# EAGLE design uirrc (EAGLE 9.6.2)
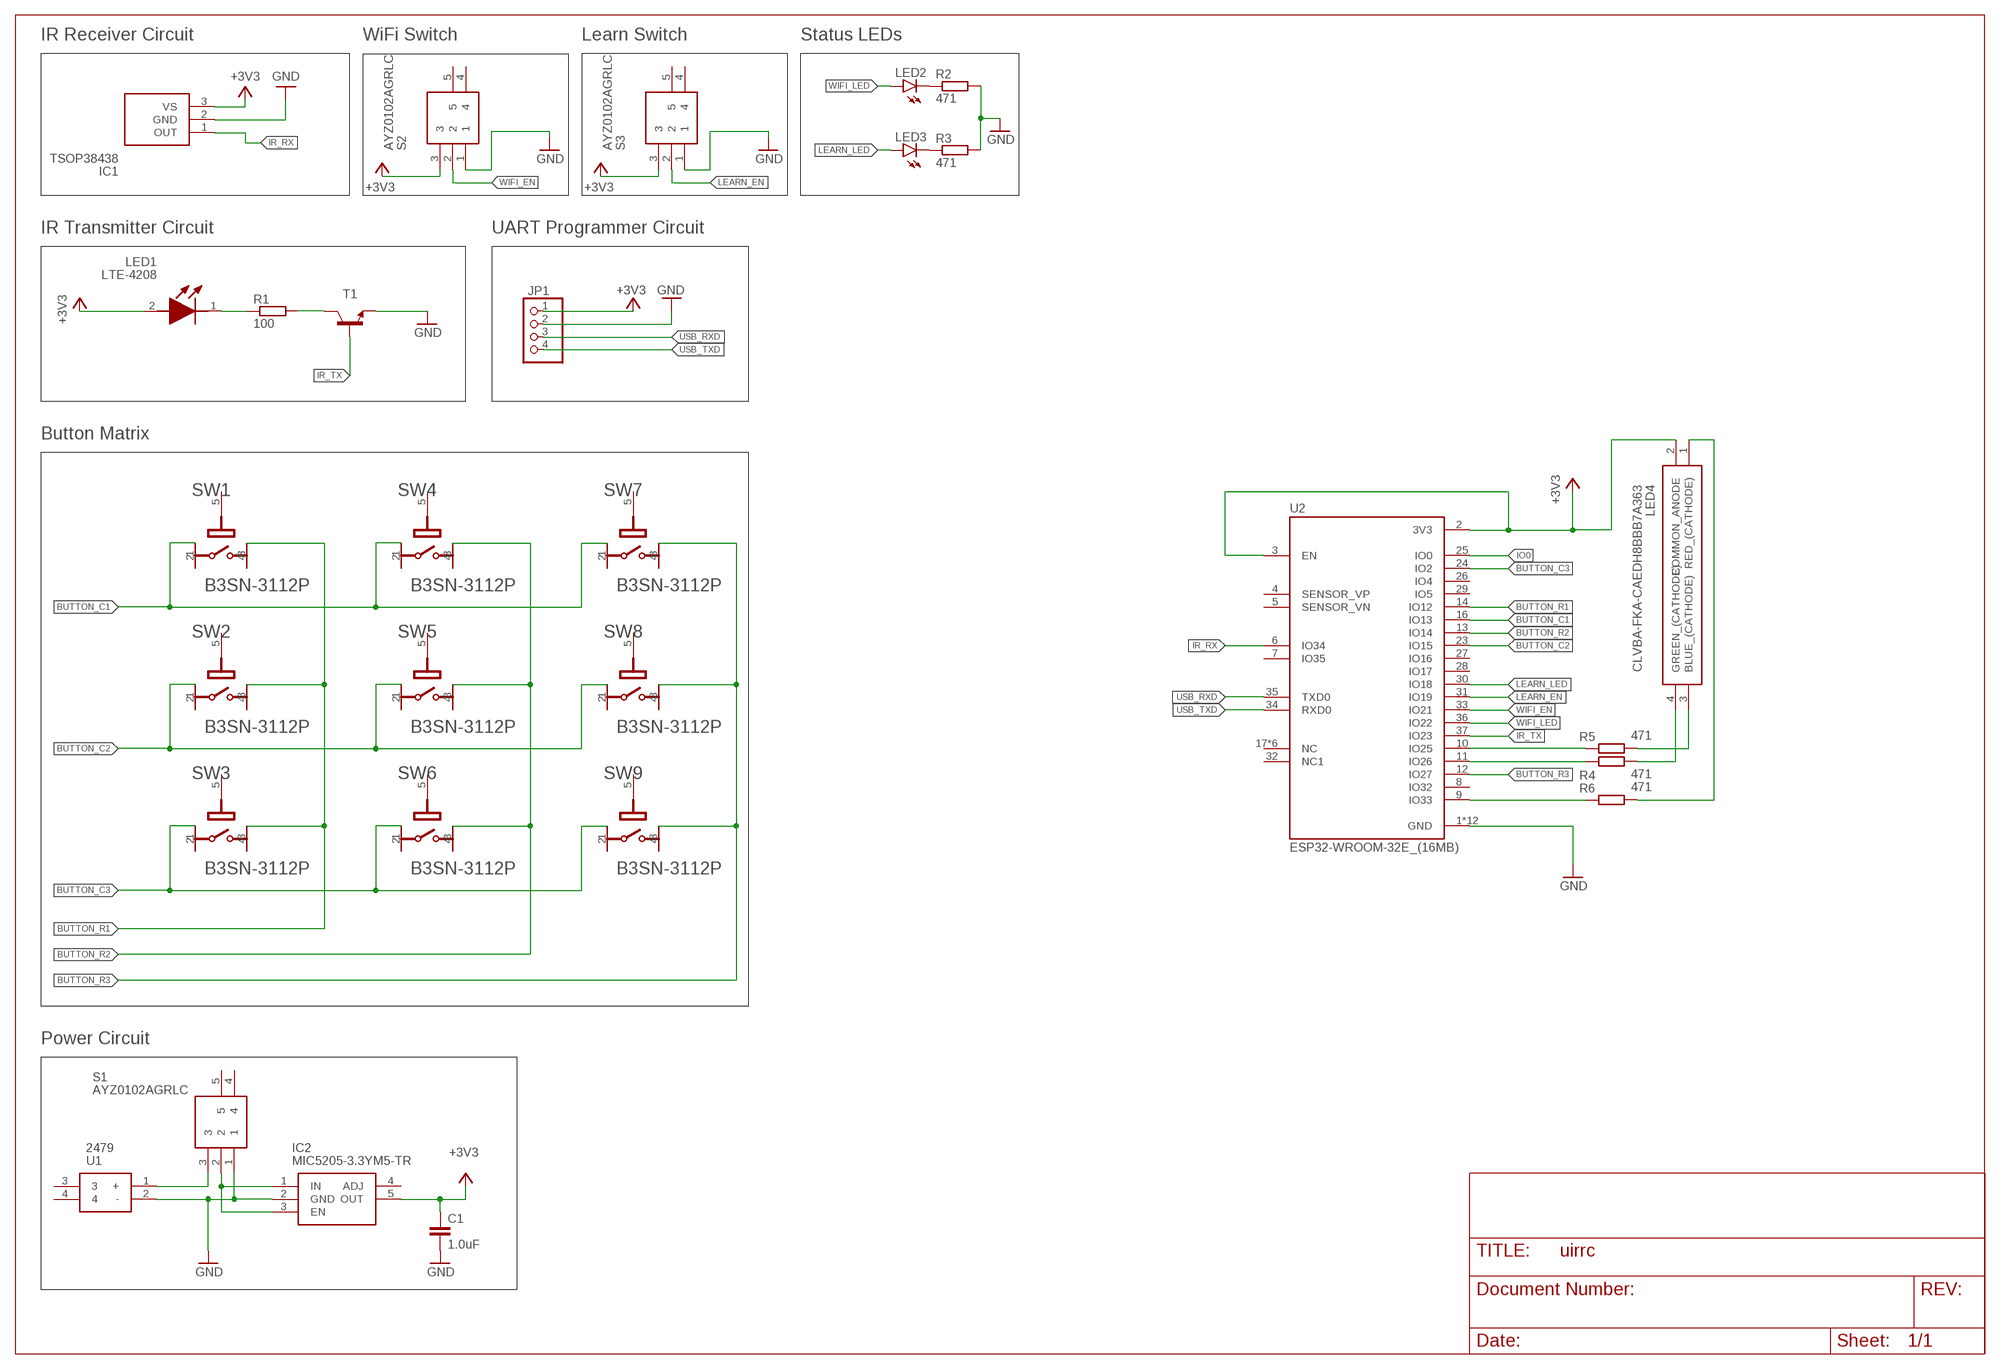
[diagram p0: schematic, sheet 1]

## Parts
C1  1.0uF  C-EUC1206  [C1206]
IC1  TSOP38438  [TSOP38238]
IC2  MIC5205-3.3YM5-TR  [SOT95P280X145-5N]
JP1  PINHD-1X4  [1X04]
LED1  LTE-4208  [LTE4208]
LED2  LEDCHIPLED_1206  [CHIPLED_1206]
LED3  LEDCHIPLED_1206  [CHIPLED_1206]
LED4  CLVBA-FKA-CAEDH8BBB7A363  [CLVBAFKACAEDH8BBB7A363]
R1  100  R-EU_R1206  [R1206]
R2  471  R-EU_R1206  [R1206]
R3  471  R-EU_R1206  [R1206]
R4  471  R-EU_R1206  [R1206]
R5  471  R-EU_R1206  [R1206]
R6  471  R-EU_R1206  [R1206]
S1  AYZ0102AGRLC  [AYZ0102AGRLC]
S2  AYZ0102AGRLC  [AYZ0102AGRLC]
S3  AYZ0102AGRLC  [AYZ0102AGRLC]
SW1  OMRON_B3SN-3112POMRON_B3SN-3112P_0_0  [OMRON_B3SN-3112P_0]
SW2  OMRON_B3SN-3112POMRON_B3SN-3112P_0_0  [OMRON_B3SN-3112P_0]
SW3  OMRON_B3SN-3112POMRON_B3SN-3112P_0_0  [OMRON_B3SN-3112P_0]
SW4  OMRON_B3SN-3112POMRON_B3SN-3112P_0_0  [OMRON_B3SN-3112P_0]
SW5  OMRON_B3SN-3112POMRON_B3SN-3112P_0_0  [OMRON_B3SN-3112P_0]
SW6  OMRON_B3SN-3112POMRON_B3SN-3112P_0_0  [OMRON_B3SN-3112P_0]
SW7  OMRON_B3SN-3112POMRON_B3SN-3112P_0_0  [OMRON_B3SN-3112P_0]
SW8  OMRON_B3SN-3112POMRON_B3SN-3112P_0_0  [OMRON_B3SN-3112P_0]
SW9  OMRON_B3SN-3112POMRON_B3SN-3112P_0_0  [OMRON_B3SN-3112P_0]
T1  MMBT3904LT1-NPN-SOT23-BEC  [SOT23-BEC]
U1  2479  [2479]
U2  ESP32-WROOM-32E_(16MB)  [XCVR_ESP32-WROOM-32E_(16MB)]

## Nets
+3V3: C1.1 IC1.3(VS) IC2.5(OUT) JP1.1 LED1.2(A) LED4.2(COMMON_ANODE) S2.3 S3.3 U2.2(3V3) U2.3(EN)
BUTTON_C1: SW1.1 SW4.1 SW7.1 U2.16(IO13)
BUTTON_C2: SW2.1 SW5.1 SW8.1 U2.23(IO15)
BUTTON_C3: SW3.1 SW6.1 SW9.1 U2.24(IO2)
BUTTON_R1: SW1.3 SW2.3 SW3.3 U2.14(IO12)
BUTTON_R2: SW4.3 SW5.3 SW6.3 U2.13(IO14)
BUTTON_R3: SW7.3 SW8.3 SW9.3 U2.12(IO27)
GND: C1.2 IC1.2(GND) IC2.2(GND) JP1.2 R2.2 R3.2 S1.1 S2.1 S3.1 T1.E U1.2(-) U2.1(GND) U2.15(GND) U2.38(GND) U2.39_1(GND) U2.39_2(GND) U2.39_3(GND) U2.39_4(GND) U2.39_5(GND) U2.39_6(GND) U2.39_7(GND) U2.39_8(GND) U2.39_9(GND)
IO0: U2.25(IO0)
IR_RX: IC1.1(OUT) U2.6(IO34)
IR_TX: T1.B U2.37(IO23)
LEARN_EN: S3.2 U2.31(IO19)
LEARN_LED: LED3.A U2.30(IO18)
N$1: LED1.1(K) R1.1
N$2: R1.2 T1.C
N$3: LED4.4(GREEN_(CATHODE)) R4.2
N$4: LED4.3(BLUE_(CATHODE)) R5.2
N$9: LED4.1(RED_(CATHODE)) R6.2
N$11: S1.3 U1.1(+)
N$13: R4.1 U2.11(IO26)
N$14: R5.1 U2.10(IO25)
N$15: R6.1 U2.9(IO33)
N$16: IC2.1(IN) IC2.3(EN) S1.2
N$18: LED3.C R3.1
N$20: LED2.C R2.1
USB_RXD: JP1.3 U2.35(TXD0)
USB_TXD: JP1.4 U2.34(RXD0)
WIFI_EN: S2.2 U2.33(IO21)
WIFI_LED: LED2.A U2.36(IO22)
Unconnected: IC2.4(ADJ) S1.4 S1.5 S2.4 S2.5 S3.4 S3.5 SW1.2 SW1.4 SW1.5 SW2.2 SW2.4 SW2.5 SW3.2 SW3.4 SW3.5 SW4.2 SW4.4 SW4.5 SW5.2 SW5.4 SW5.5 SW6.2 SW6.4 SW6.5 SW7.2 SW7.4 SW7.5 SW8.2 SW8.4 SW8.5 SW9.2 SW9.4 SW9.5 U1.3 U1.4 U2.4(SENSOR_VP) U2.5(SENSOR_VN) U2.7(IO35) U2.8(IO32) U2.17(NC) U2.18(NC) U2.19(NC) U2.20(NC) U2.21(NC) U2.22(NC) U2.26(IO4) U2.27(IO16) U2.28(IO17) U2.29(IO5) U2.32(NC1)

## Notes on the sheet
- IR Receiver Circuit | WiFi Switch | Learn Switch | Status LEDs
- IR Transmitter Circuit | UART Programmer Circuit
- Button Matrix
- Power Circuit

## Library data of the parts
C1 = rcl:C-EU: CAPACITOR, European symbol; SPICEPREFIX: C
IC1 = TSOP38438:TSOP38438: IR Remote Receiver 38KHz 45m Source: Datasheet <http://www.vishay.com/docs/82491/tsop382.pdf>; DESCRIPTION: IR Remote Receiver 38KHz 45m; HEIGHT: mm; MANUFACTURER_NAME: Vishay; MANUFACTURER_PART_NUMBER: TSOP38438; MOUSER_PART_NUMBER: 78-TSOP38438; MOUSER_PRICE-STOCK: https://www.mouser.co.uk/ProductDetail/Vishay-Semiconductors/TSOP38438?qs=fbkhFuCHoTaKUNuf%2Fea2zA%3D%3D
IC2 = MIC5205-3.3YM5-TR:MIC5205-3.3YM5-TR: 150mA 1% Low Noise LDO MIC5205-3.3YM5 TR Microchip MIC5205-3.3YM5-TR, LDO Voltage Regulator, 150mA, 3.3 V 1%, 2.5 16 Vin, 5-Pin SOT-23 Source: Datasheet <http://ww1.microchip.com/downloads/en/DeviceDoc/20005785A.pdf>; DESCRIPTION: 150mA 1% Low Noise LDO MIC5205-3.3YM5 TR Microchip MIC5205-3.3YM5-TR, LDO Voltage Regulator, 150mA, 3.3 V 1%, 2.5 16 Vin, 5-Pin SOT-23; HEIGHT: 1.45mm; MANUFACTURER_NAME: Microchip; MANUFACTURER_PART_NUMBER: MIC5205-3.3YM5-TR; MOUSER_PART_NUMBER: 998-MIC5205-3.3YM5TR; MOUSER_PRICE-STOCK: https://www.mouser.co.uk/ProductDetail/Microchip-Technology-Atmel/MIC5205-3.3YM5-TR?qs=U6T8BxXiZAUfeWKvTx3acw%3D%3D
JP1 = pinhead:PINHD-1X4: PIN HEADER
LED1 = LTE-4208:LTE-4208: Infrared Emitters Ired 940nm 5mm Water Clr 50mA Source: Datasheet <https://componentsearchengine.com/Datasheets/1/LTE-4208.pdf>; DESCRIPTION: Infrared Emitters Ired 940nm 5mm Water Clr 50mA; HEIGHT: 9.85mm; MANUFACTURER_NAME: Lite-On; MANUFACTURER_PART_NUMBER: LTE-4208; MOUSER_PART_NUMBER: 859-LTE4208; MOUSER_PRICE-STOCK: https://www.mouser.com/Search/Refine.aspx?Keyword=859-LTE4208
LED2 LED3 = led:LED: LED OSRAM: - CHIPLED LG R971, LG N971, LY N971, LG Q971, LY Q971, LO R971, LY R971 LH N974, LH R974 LS Q976, LO Q976, LY Q976 LO Q996 - Hyper CHIPLED LW Q18S LB Q993, LB Q99A, LB R99A - SideLED LS A670, LO A670, LY A670, LG A670, LP A670 LB A673, LV A673, LT A673, LW A673 LH A674 LY A675 LS A676, LA A676, LO A676, LY A676, LW A676 LS A679, LY A679, LG A679 - Hyper Micro SIDELED® LS Y876, LA Y876, LO Y876, LY Y876 LT Y87S - SmartLED LW L88C, LW L88S LB L89C, LB L89S, LG L890 LS L89K, LO L89K, LY L89K LS L896, LA L896, LO L896, LY L896 - TOPLED LS T670, LO T670, LY T670, LG T670, LP T670 LSG T670, LSP T670, LSY T670, LOP T670, LYG T670 LG T671, LOG T671, LSG T671 LB T673, LV T673, LT T673, LW T673 LH T674 LS T676, LA T676, LO T676, LY T676, LB T676, LH T676, LSB T676, LW T676 LB T67C, LV T67C, LT T67C, LS T67K, LO T67K, LY T67K, LW E67C LS E67B, LA E67B, LO E67B, LY E67B, LB E67C, LV E67C, LT E67C LW T67C LS T679, LY T679, LG T679 LS T770, LO T770, LY T770, LG T770, LP T770 LB T773, LV T773, LT T773, LW T773 LH T774 LS E675, LA E675, LY E675, LS T675 LS T776, LA T776, LO T776, LY T776, LB T776 LHGB T686 LT T68C, LB T68C - Hyper Mini TOPLED® LB M676 - Mini TOPLED Santana® LG M470 LS M47K, LO M47K, LY M47K Source: http://www.osram.convergy.de LUXEON: - LUMILED® LXK2-PW12-R00, LXK2-PW12-S00, LXK2-PW14-U00, LXK2-PW14-V00 LXK2-PM12-R00, LXK2-PM12-S00, LXK2-PM14-U00 LXK2-PE12-Q00, LXK2-PE12-R00, LXK2-PE12-S00, LXK2-PE14-T00, LXK2-PE14-U00 LXK2-PB12-K00, LXK2-PB12-L00, LXK2-PB12-M00, LXK2-PB14-N00, LXK2-PB14-P00, LXK2-PB14-Q00 LXK2-PR12-L00, LXK2-PR12-M00, LXK2-PR14-Q00, LXK2-PR14-R00 LXK2-PD12-Q00, LXK2-PD12-R00, LXK2-PD12-S00 LXK2-PH12-R00, LXK2-PH12-S00 LXK2-PL12-P00, LXK2-PL12-Q00, LXK2-PL12-R00 Source: www.luxeon.com KINGBRIGHT: KA-3528ASYC Source: www.kingbright.com
LED4 = CLVBA-FKA-CAEDH8BBB7A363:CLVBA-FKA-CAEDH8BBB7A363: Cree,LED,CLVBA-FKA-CAEDH8BBB7A363 Cree CLVBA-FKA-CAEDH8BBB7A363 Green LED, 540 nm PLCC 4, Round Lens SMD package Source: Datasheet <http://www.cree.com/led-components/media/documents/ds-CLVBA-FKA.pdf>; DESCRIPTION: Cree,LED,CLVBA-FKA-CAEDH8BBB7A363 Cree CLVBA-FKA-CAEDH8BBB7A363 Green LED, 540 nm PLCC 4, Round Lens SMD package; HEIGHT: 2.1mm; MANUFACTURER_NAME: Wolfspeed; MANUFACTURER_PART_NUMBER: CLVBA-FKA-CAEDH8BBB7A363; MOUSER_PART_NUMBER: 941-VBAFKACAEDH8B7A3; MOUSER_PRICE-STOCK: https://www.mouser.co.uk/ProductDetail/Cree-LED/CLVBA-FKA-CAEDH8BBB7a363?qs=3AcK5DacLboXYkg4biCgSA%3D%3D
R1-R6 = rcl:R-EU_: RESISTOR, European symbol; SPICEPREFIX: R
S1-S3 = AYZ0102AGRLC:AYZ0102AGRLC: Switch slide 100mA 12VDC SPDT PCB Slide Switch SPDT On-On 100 mA Slide Source: Datasheet <https://componentsearchengine.com/Datasheets/3/AYZ0102AGRLC.pdf>; DESCRIPTION: Switch slide 100mA 12VDC SPDT PCB Slide Switch SPDT On-On 100 mA Slide; HEIGHT: 1mm; MANUFACTURER_NAME: C & K COMPONENTS; MANUFACTURER_PART_NUMBER: AYZ0102AGRLC; MOUSER_PART_NUMBER: 611-AYZ0102AGRLC; MOUSER_PRICE-STOCK: https://www.mouser.co.uk/ProductDetail/CK/AYZ0102AGRLC?qs=dJbzCyn%252BCFYWKwcWEToS6A%3D%3D
SW1-SW9 = Omron - B3SN-3112P:OMRON_B3SN-3112P: Tactile Switch SPST-NO Top Actuated Surface Mount; AMBIENT_TEMPERATURE_RANGE_HIGH: +70°C; AMBIENT_TEMPERATURE_RANGE_LOW: -25°C; AUTOMOTIVE: No; CENTROID_NOT_SPECIFIED: No; CONTACT_CURRENT_RATING: 50mA; CONTACT_RESISTANCE: 100mΩ; DATASHEET: https://omronfs.omron.com/en_US/ecb/products/pdf/en-b3sn.pdf; DEVICE_CLASS_L1: Electromechanical; DEVICE_CLASS_L2: Switches; DEVICE_CLASS_L3: Tactile Switches; DIGIKEY_DESCRIPTION: SWITCH TACTILE SPST-NO 0.05A 24V; DIGIKEY_PART_NUMBER: SW262CT-ND; ELECTROMECHANICAL_LIFE: 100000Cycles; FOOTPRINT_VARIANT_NAME_0: Recommended_Land_Pattern; LEAD_FREE: Yes; MF: Omron; MFG_PACKAGE_IDENT: 0; MFG_PACKAGE_IDENT_DATE: 0; MFG_PACKAGE_IDENT_REV: 0; MOUNT: Surface Mount; MOUSER_DESCRIPTION: Switch Tactile N.O. SPST Round Button J-Bend 0.05A 24VDC 50000Cycle 1.57N SMD Embossed Tape; MOUSER_PART_NUMBER: 653-B3SN-3112P; MPN: B3SN-3112P; OPERATING_FORCE: 1.57N; PACKAGE: SMT_SW_6MM0_6MM0; PREFIX: SW; ROHS: Yes; STANDOFF_HEIGHT: 3.4mm; TEMPERATURE_RANGE_HIGH: +70°C; TEMPERATURE_RANGE_LOW: -25°C; THROW_CONFIGURATION: SPST-NO; VERIFICATION_VERSION: 0.0.0.3; VOLTAGE_RATING_DC: 24V
T1 = transistor:*-NPN-: NPN Transistror BF959 corrected 2008.03.06
U1 = 2479:2479: KEYSTONE - 2479 - BATTERY HOLDER, AAA, 3WAY Source: Datasheet <http://www.keyelco.com/product-pdf.cfm?p=1041>; DESCRIPTION: KEYSTONE - 2479 - BATTERY HOLDER, AAA, 3WAY; HEIGHT: 13mm; MANUFACTURER_NAME: Keystone Electronics; MANUFACTURER_PART_NUMBER: 2479; MOUSER_PART_NUMBER: 534-2479; MOUSER_PRICE-STOCK: https://www.mouser.co.uk/ProductDetail/Keystone-Electronics/2479?qs=Q3RoVmURDomBPD85HfXZoA%3D%3D
U2 = ESP32-WROOM-32E__16MB_:ESP32-WROOM-32E_(16MB): Check availability <https://pricing.snapeda.com/parts/ESP32-WROOM-32E%20%2816MB%29/Espressif%20Systems/view-part?ref=eda>; AVAILABILITY: Not in stock; DESCRIPTION: Bluetooth, WiFi 802.11b/g/n, Bluetooth v4.2 +EDR, Class 1, 2 and 3 Transceiver Module 2.4GHz ~ 2.5GHz Integrated, Trace Surface Mount; MF: Espressif Systems; MP: ESP32-WROOM-32E (16MB); PACKAGE: None; PRICE: None

## Board
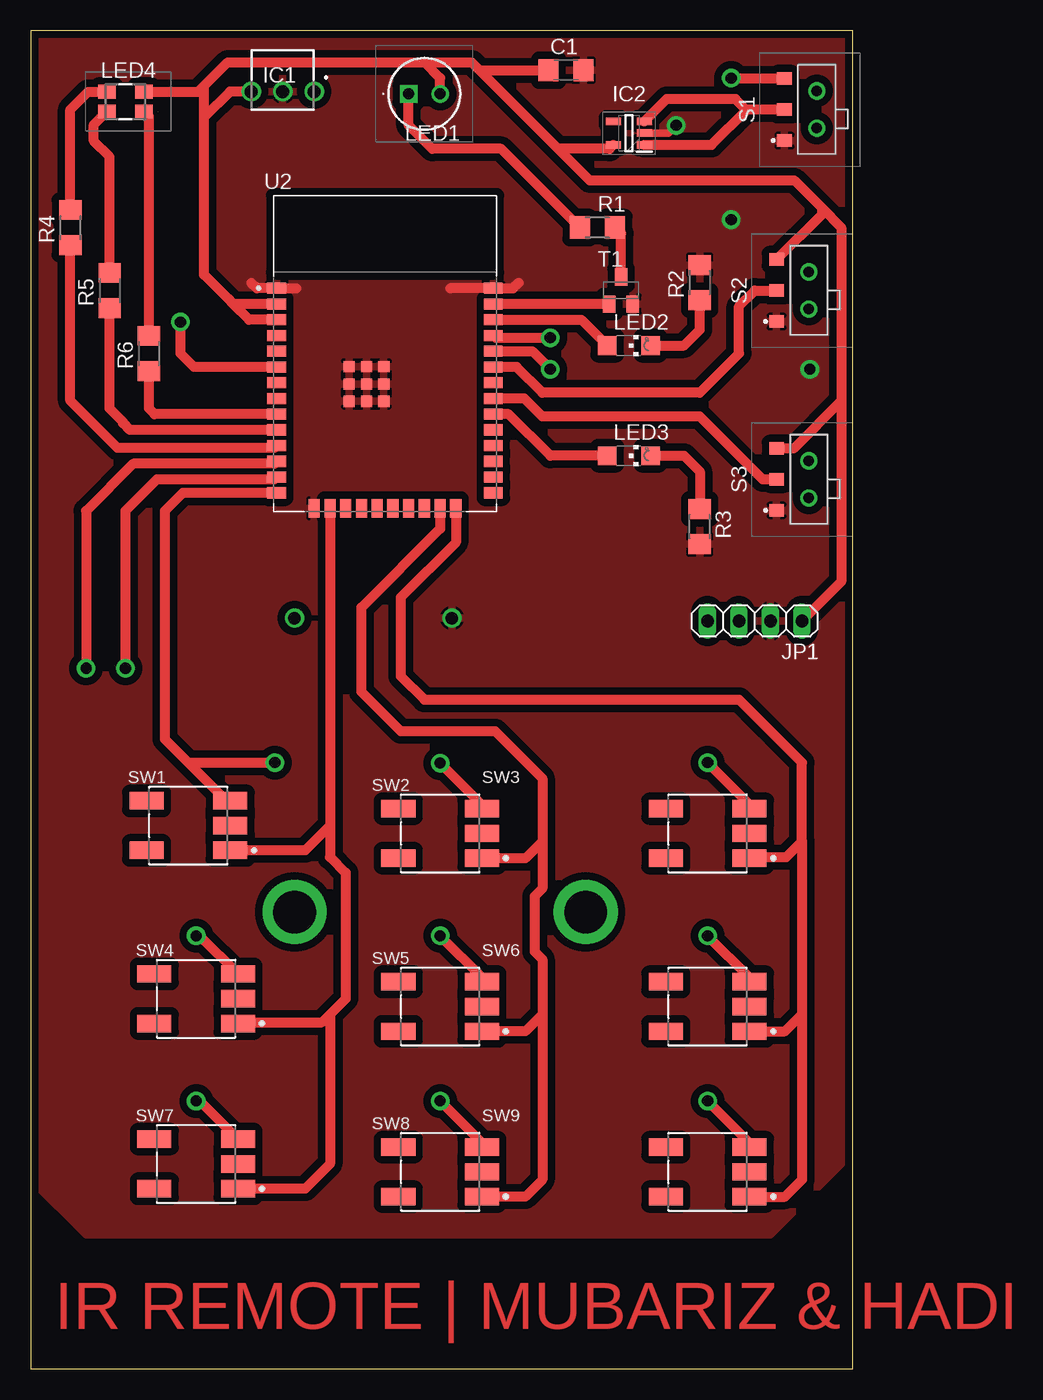
[diagram p1: board, top side]
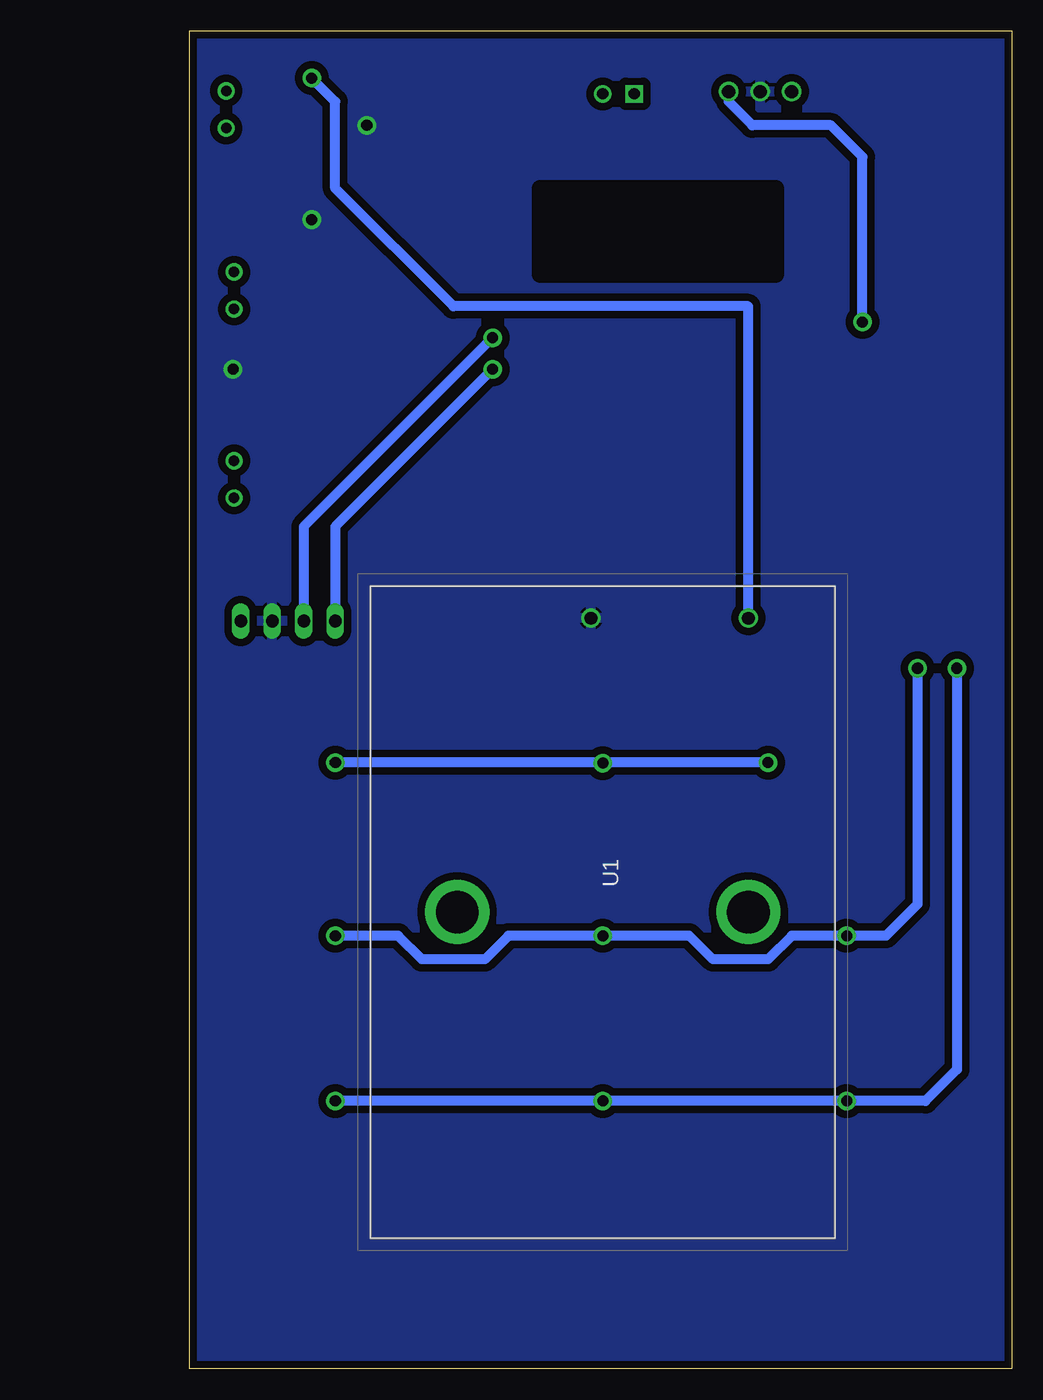
[diagram p2: board, bottom side, seen from below]

Size 66.34 x 107.94 mm. Coordinates in mm from the lower left corner, seen from the top.
Outline: 0,0 66.34,0 66.34,107.94 0,107.94 0,0
Copper layers (1*16): Top 0.035mm / dielectric 1.5mm / Bottom 0.035mm
Design rules "DesignRules *": minimum track width 6mil, minimum drill 12mil, track to track 6mil, track to pad 6mil, pad to pad 6mil, via to via 6mil, smd to smd 6mil, copper to edge 20mil, drill to drill 8mil, minimum pad ring 8mil, minimum via ring 6mil, stop-mask expansion 3mil, vias tented up to drill 0mil, thermal gap 8mil
bRestrict: area 19.1,88.3 to 38.1,95.2

### Footprints (pad centres in the part's own frame; a part is rotated, then mirrored left to right if it is on the bottom)
C1206 = smd 1.6 x 1.8: 1 -1.4,0; 2 1.4,0
TSOP38238 = drill 1.06 pad 1.56: 1 -2.54,-1.45; 2 0,-1.45; 3 2.54,-1.45
SOT95P280X145-5N = smd 1.2 x 0.6: 1 -1.25,0.95; 2 -1.25,0; 3 -1.25,-0.95; 4 1.25,-0.95; 5 1.25,0.95
1X04 = drill 1.016 long: 1 -3.81,0; 2 -1.27,0; 3 1.27,0; 4 3.81,0
LTE4208 = drill 0.91 pad 1.416 square: 1 0,0 | drill 0.91 pad 1.416: 2 -2.54,0
CHIPLED_1206 = smd 1.5 x 1.5: A 0,-1.75; C 0,1.75
CLVBAFKACAEDH8BBB7A363 = smd 1.4 x 1.1: 1 -1.5,0.8; 2 -1.5,-0.8; 3 1.5,0.8; 4 1.5,-0.8
R1206 = smd 1.6 x 1.803: 1 -1.422,0; 2 1.422,0
AYZ0102AGRLC = smd 1 x 1.2: 1 -2.5,2.05; 2 0,2.05; 3 2.5,2.05 | drill 0.85 pad 1.381: 4 -1.5,-0.55; 5 1.5,-0.55
OMRON_B3SN-3112P_0 = smd 2.75 x 1.4: 1 3.375,-2; 2 -3.375,-2; 3 3.375,2; 4 -3.375,2; 5 3.375,0
SOT23-BEC = smd 1 x 1.4: B -0.95,-1.1; C 0,1.1; E 0.95,-1.1
2479 = drill 1.02 pad 1.53: 1 23.725,-11.75; 2 23.725,0.95 | drill 3.45 pad 5.175: 3 0.005,-11.75; 4 0.005,11.75
XCVR_ESP32-WROOM-32E_(16MB) = smd 1.5 x 0.9: 1 -8.75,5.26; 2 -8.75,3.99; 3 -8.75,2.72; 4 -8.75,1.45; 5 -8.75,0.18; 6 -8.75,-1.09; 7 -8.75,-2.36; 8 -8.75,-3.63; 9 -8.75,-4.9; 10 -8.75,-6.17; 11 -8.75,-7.44; 12 -8.75,-8.71; 13 -8.75,-9.98; 14 -8.75,-11.25; 25 8.75,-11.25; 26 8.75,-9.98; 27 8.75,-8.71; 28 8.75,-7.44; 29 8.75,-6.17; 30 8.75,-4.9; 31 8.75,-3.63; 32 8.75,-2.36; 33 8.75,-1.09; 34 8.75,0.18; 35 8.75,1.45; 36 8.75,2.72; 37 8.75,3.99; 38 8.75,5.26 | smd 0.9 x 1.5: 15 -5.715,-12.5; 16 -4.445,-12.5; 17 -3.175,-12.5; 18 -1.905,-12.5; 19 -0.635,-12.5; 20 0.635,-12.5; 21 1.905,-12.5; 22 3.175,-12.5; 23 4.445,-12.5; 24 5.715,-12.5 | smd 0.9 x 0.9: 39_1 -2.9,-1.06; 39_2 -1.5,-1.06; 39_3 -0.1,-1.06; 39_4 -2.9,-2.46; 39_5 -1.5,-2.46; 39_6 -0.1,-2.46; 39_7 -2.9,-3.86; 39_8 -1.5,-3.86; 39_9 -0.1,-3.86

### Placement (x,y rotation side)
C1  43.18,104.78 0 top
IC1  20.32,101.6 180 top
IC2  48.26,99.69 180 top
JP1  58.42,60.33 180 top
LED1  30.48,102.87 180 top
LED2  48.26,82.55 270 top
LED3  48.26,73.66 270 top
LED4  7.62,102.23 180 top
R1  45.72,92.08 0 top
R2  53.98,87.63 90 top
R3  53.98,67.95 270 top
R4  3.17,92.08 90 top
R5  6.35,87 90 top
R6  9.53,81.92 90 top
S1  62.87,101.6 90 top
S2  62.23,87 90 top
S3  62.23,71.75 90 top
SW1  12.7,43.81 0 top
SW2  33.02,43.18 0 top
SW3  54.61,43.18 0 top
SW4  13.34,29.84 0 top
SW5  33.02,29.21 0 top
SW6  54.61,29.21 0 top
SW7  13.34,16.51 0 top
SW8  33.02,15.88 0 top
SW9  54.61,15.88 0 top
T1  47.62,87 0 top
U1  33.02,36.83 90 bottom
U2  28.57,81.92 0 top

### Tracks (layer width: path | path; a pad name or v marks a point on that pad's centre or on a via)
+3V3
  Top 0.8: U2.3 17.6,84.64 16.33,85.91 | 13.97,100.97 13.97,88.27 15.88,86.36 16.33,85.91 | 13.97,100.97 13.97,103.5 | 36.2,104.78 35.56,105.41 31.75,105.41 | 36.2,104.78 42.55,98.42 | 13.97,103.5 15.88,105.41 31.75,105.41 | LED4.2 13.5,103.03 13.97,103.5 | IC1.3 16.05,103.05 13.97,100.97 | LED1.2 33.02,104.14 31.75,105.41 | 36.2,104.78 C1.1 | 42.55,98.42 45.09,95.89 61.59,95.89 63.82,93.66 | 63.82,93.66 65.41,92.08 65.41,78.11 | 65.41,78.11 65.41,63.5 JP1.1 | 63.82,93.66 63.82,93.13 S2.3 | 65.41,78.11 61.55,74.25 S3.3 | IC2.5 46.69,98.42 42.55,98.42 | U2.2 16.33,85.91
BUTTON_C1
  Top 0.8: U2.16 24.13,43.81 | 24.13,43.81 22.13,41.81 SW1.1 | 24.13,43.81 24.13,41.27 25.4,40.01 25.4,29.84 24.13,28.57 | 24.13,28.57 24.13,16.51 22.13,14.51 SW7.1 | SW4.1 16.8,27.94 23.5,27.94 24.13,28.57
BUTTON_C2
  Top 0.8: 41.27,42.55 41.27,47.62 37.47,51.44 29.84,51.44 26.67,54.61 26.67,61.42 33.02,67.77 U2.23 | 41.27,42.55 39.91,41.18 SW2.1 | 41.27,42.55 41.27,38.73 40.64,38.1 40.64,33.66 41.27,33.02 41.27,28.57 | 41.27,28.57 39.91,27.21 SW5.1 | 41.27,28.57 41.27,15.24 39.91,13.88 SW8.1
BUTTON_C3
  Top 0.8: U2.24 34.29,66.67 29.84,62.23 29.84,55.88 31.75,53.98 57.15,53.98 62.23,48.89 62.23,42.55 | SW3.1 58.08,41.27 60.96,41.27 62.23,42.55 | 62.23,42.55 62.23,28.57 | 62.23,28.57 62.23,15.24 60.87,13.88 SW9.1 | SW6.1 60.87,27.21 62.23,28.57
BUTTON_R1  (via drill 0.9 pad 1.5)
  Top 0.8: U2.14 12.24,70.67 10.79,69.22 10.79,50.8 12.7,48.89 | 12.7,48.89 15.78,45.81 SW1.3 | 12.7,48.89 v19.68,48.89 | v33.02,48.86 36.4,45.49 SW2.3 | v54.61,48.89 57.98,45.52 SW3.3
  Bottom 0.8: v19.68,48.89 32.99,48.89 v33.02,48.86 33.05,48.89 v54.61,48.89
BUTTON_R2  (via drill 0.9 pad 1.5)
  Top 0.8: U2.13 19.64,71.75 10.16,71.75 7.62,69.22 v7.62,56.52 | SW4.3 13.63,34.93 v13.34,34.93 | v33.02,34.93 36.4,31.55 SW5.3 | v54.61,34.93 57.98,31.55 SW6.3
  Bottom 0.8: v7.62,56.52 7.62,37.47 10.16,34.93 v13.34,34.93 17.78,34.93 19.68,33.02 24.13,33.02 26.04,34.93 v33.02,34.93 40.64,34.93 42.55,33.02 47.62,33.02 49.53,34.93 v54.61,34.93
BUTTON_R3  (via drill 0.9 pad 1.5)
  Top 0.8: U2.12 19.64,73.03 8.26,73.03 4.45,69.22 v4.45,56.52 | v13.34,21.59 13.63,21.59 SW7.3 | v33.02,21.59 36.4,18.21 SW8.3 | v54.61,21.59 57.98,18.21 SW9.3
  Bottom 0.8: v4.45,56.52 4.45,24.13 6.99,21.59 v13.34,21.59 v33.02,21.59 v54.61,21.59
GND  (via drill 0.9 pad 1.5)
  Top 0.6: IC2.2 51.44,99.69 v52.07,100.33
  Top 0.8: 33.84,87.17 U2.38 38.91,87.17 39.37,87.63 | 17.78,87.63 18.23,87.17 U2.1 21.41,87.17
  other vias: 56.52,92.71 62.87,80.64
  pour Top (isolate 0.6): 0,107.95 66.04,107.95 66.04,17.14 59.69,10.79 4.45,10.79 0,15.24
  pour Bottom (isolate 0.6): 0,107.95 66.04,107.95 66.04,0 0,0
IR_RX  (via drill 0.9 pad 1.5)
  Top 0.8: v12.06,84.45 12.06,81.92 13.15,80.83 U2.6
  Bottom 0.8: v12.06,84.45 12.06,97.79 14.61,100.33 20.95,100.33 22.86,102.23 IC1.1
IR_TX
  Top 0.8: T1.B U2.37
LEARN_EN
  Top 0.8: S3.2 59.05,71.75 53.98,76.83 41.27,76.83 39.83,78.28 U2.31
LEARN_LED
  Top 0.8: LED3.A 41.91,73.66 38.55,77.02 U2.30
N$1
  Top 0.8: R1.1 37.95,98.42 32.38,98.42 30.48,100.33 LED1.1
N$2
  Top 0.8: T1.C 47.62,91.59 R1.2
N$3
  Top 0.8: R4.2 3.17,101.6 4.61,103.03 LED4.4
N$4
  Top 0.8: R5.2 6.35,97.79 5.08,99.06 5.08,100.39 LED4.3
N$9
  Top 0.8: R6.2 9.53,101.03 LED4.1
N$11  (via drill 0.9 pad 1.5)
  Top 0.8: v56.52,104.14 60.77,104.14 S1.3
  Bottom 0.8: U1.1 21.27,85.72 45.09,85.72 54.61,95.25 54.61,102.23 v56.52,104.14
N$13
  Top 0.8: U2.11 19.64,74.3 6.99,74.3 3.17,78.11 R4.1
N$14
  Top 0.8: U2.10 7.98,75.75 7.44,76.29 7.44,76.38 6.35,77.47 R5.1
N$15
  Top 0.8: U2.9 9.98,77.02 9.53,77.47 R6.1
N$16
  Top 0.8: IC2.3 51.3,102.43 56.87,102.43 57.7,101.6 57.78,101.6 | S1.2 57.78,101.6 | IC2.1 54.93,98.75 57.78,101.6
N$18
  Top 0.8: LED3.C 52.7,73.66 53.98,72.39 R3.1
N$20
  Top 0.8: LED2.C 52.7,82.55 53.98,83.82 R2.1
USB_RXD  (via drill 0.9 pad 1.5)
  Top 0.8: U2.35 37.51,83.19 v41.91,83.19
  Bottom 0.8: v41.91,83.19 57.15,67.95 JP1.3
USB_TXD  (via drill 0.9 pad 1.5)
  Top 0.8: U2.34 40.46,82.09 v41.91,80.64
  Bottom 0.8: v41.91,80.64 54.61,67.95 JP1.4
WIFI_EN
  Top 0.8: S2.2 58.42,87 57.15,85.72 57.15,81.92 53.98,78.74 41.27,78.74 39.19,80.83 U2.33
WIFI_LED
  Top 0.8: U2.36 44.42,84.64 LED2.A

### Text on the board
Top: IR REMOTE | MUBARIZ & HADI